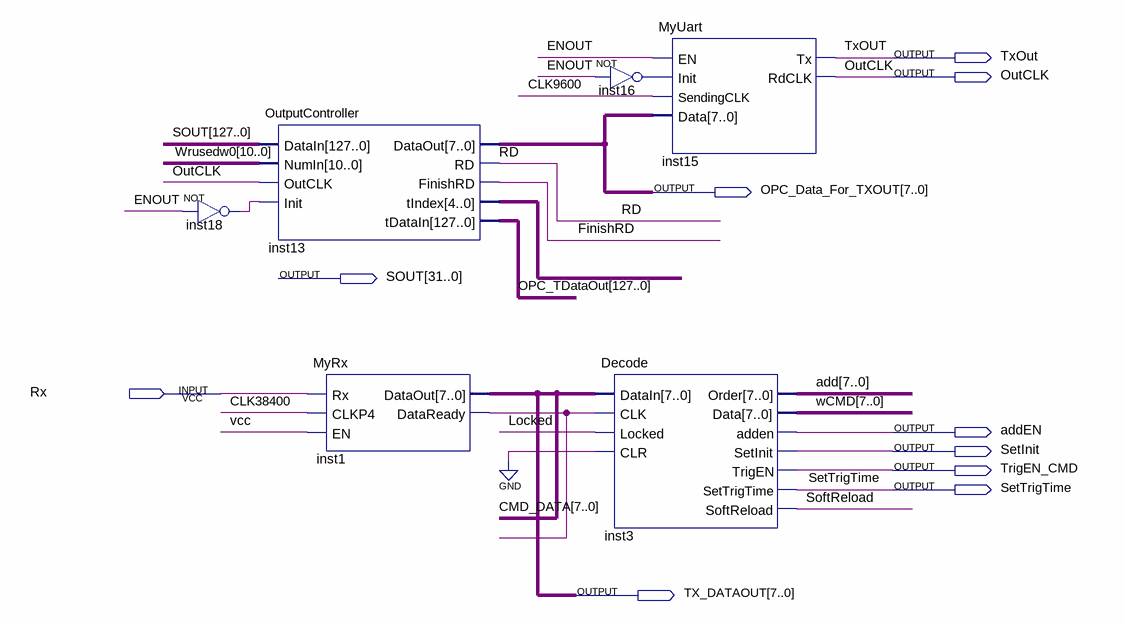
[diagram p0: schematic sheet]
// Quartus schematic UartTop.bdf as structural Verilog: 6 symbols, 10 pins
module UartTop (
  input  Rx,
  output TxOut,
  output OutCLK,
  output [7:0] OPC_Data_For_TXOUT,
  output [127:0] SOUT,
  output addEN,
  output SetInit,
  output TrigEN_CMD,
  output SetTrigTime,
  output [7:0] TX_DATAOUT
);

  wire CLK9600, CLK38400, ENOUT, FinishRD, inst1_dataready, inst16_out, inst18_out, Locked, RD, SoftReload,
       vcc;
  wire [4:0] inst13_tindex;
  wire [7:0] add, wCMD;
  wire [10:0] Wrusedw0;
  wire [127:0] OPC_TDataOut;

  not inst18 (inst18_out, ENOUT);
  OutputController inst13 (
    .DataIn(SOUT), .NumIn(Wrusedw0), .OutCLK(OutCLK), .Init(inst18_out), .DataOut(OPC_Data_For_TXOUT),
    .RD(RD), .FinishRD(FinishRD), .tIndex(inst13_tindex), .tDataIn(OPC_TDataOut));
  MyRx inst1 (.Rx(Rx), .CLKP4(CLK38400), .EN(vcc), .DataOut(TX_DATAOUT), .DataReady(inst1_dataready));
  not inst16 (inst16_out, ENOUT);
  Decode inst3 (
    .DataIn(TX_DATAOUT), .CLK(inst1_dataready), .Locked(Locked), .CLR(1'b0), .Order(add), .Data(wCMD),
    .adden(addEN), .SetInit(SetInit), .TrigEN(TrigEN_CMD), .SetTrigTime(SetTrigTime), .SoftReload(SoftReload));
  MyUart inst15 (
    .EN(ENOUT), .Init(inst16_out), .SendingCLK(CLK9600), .Data(OPC_Data_For_TXOUT), .Tx(TxOut), .RdCLK(OutCLK));

  // Other names for the same wires on the sheet: CMD_DATA[7:0] = TX_DATAOUT
endmodule
